# Altium schematic sheet System.SchDoc
size A3
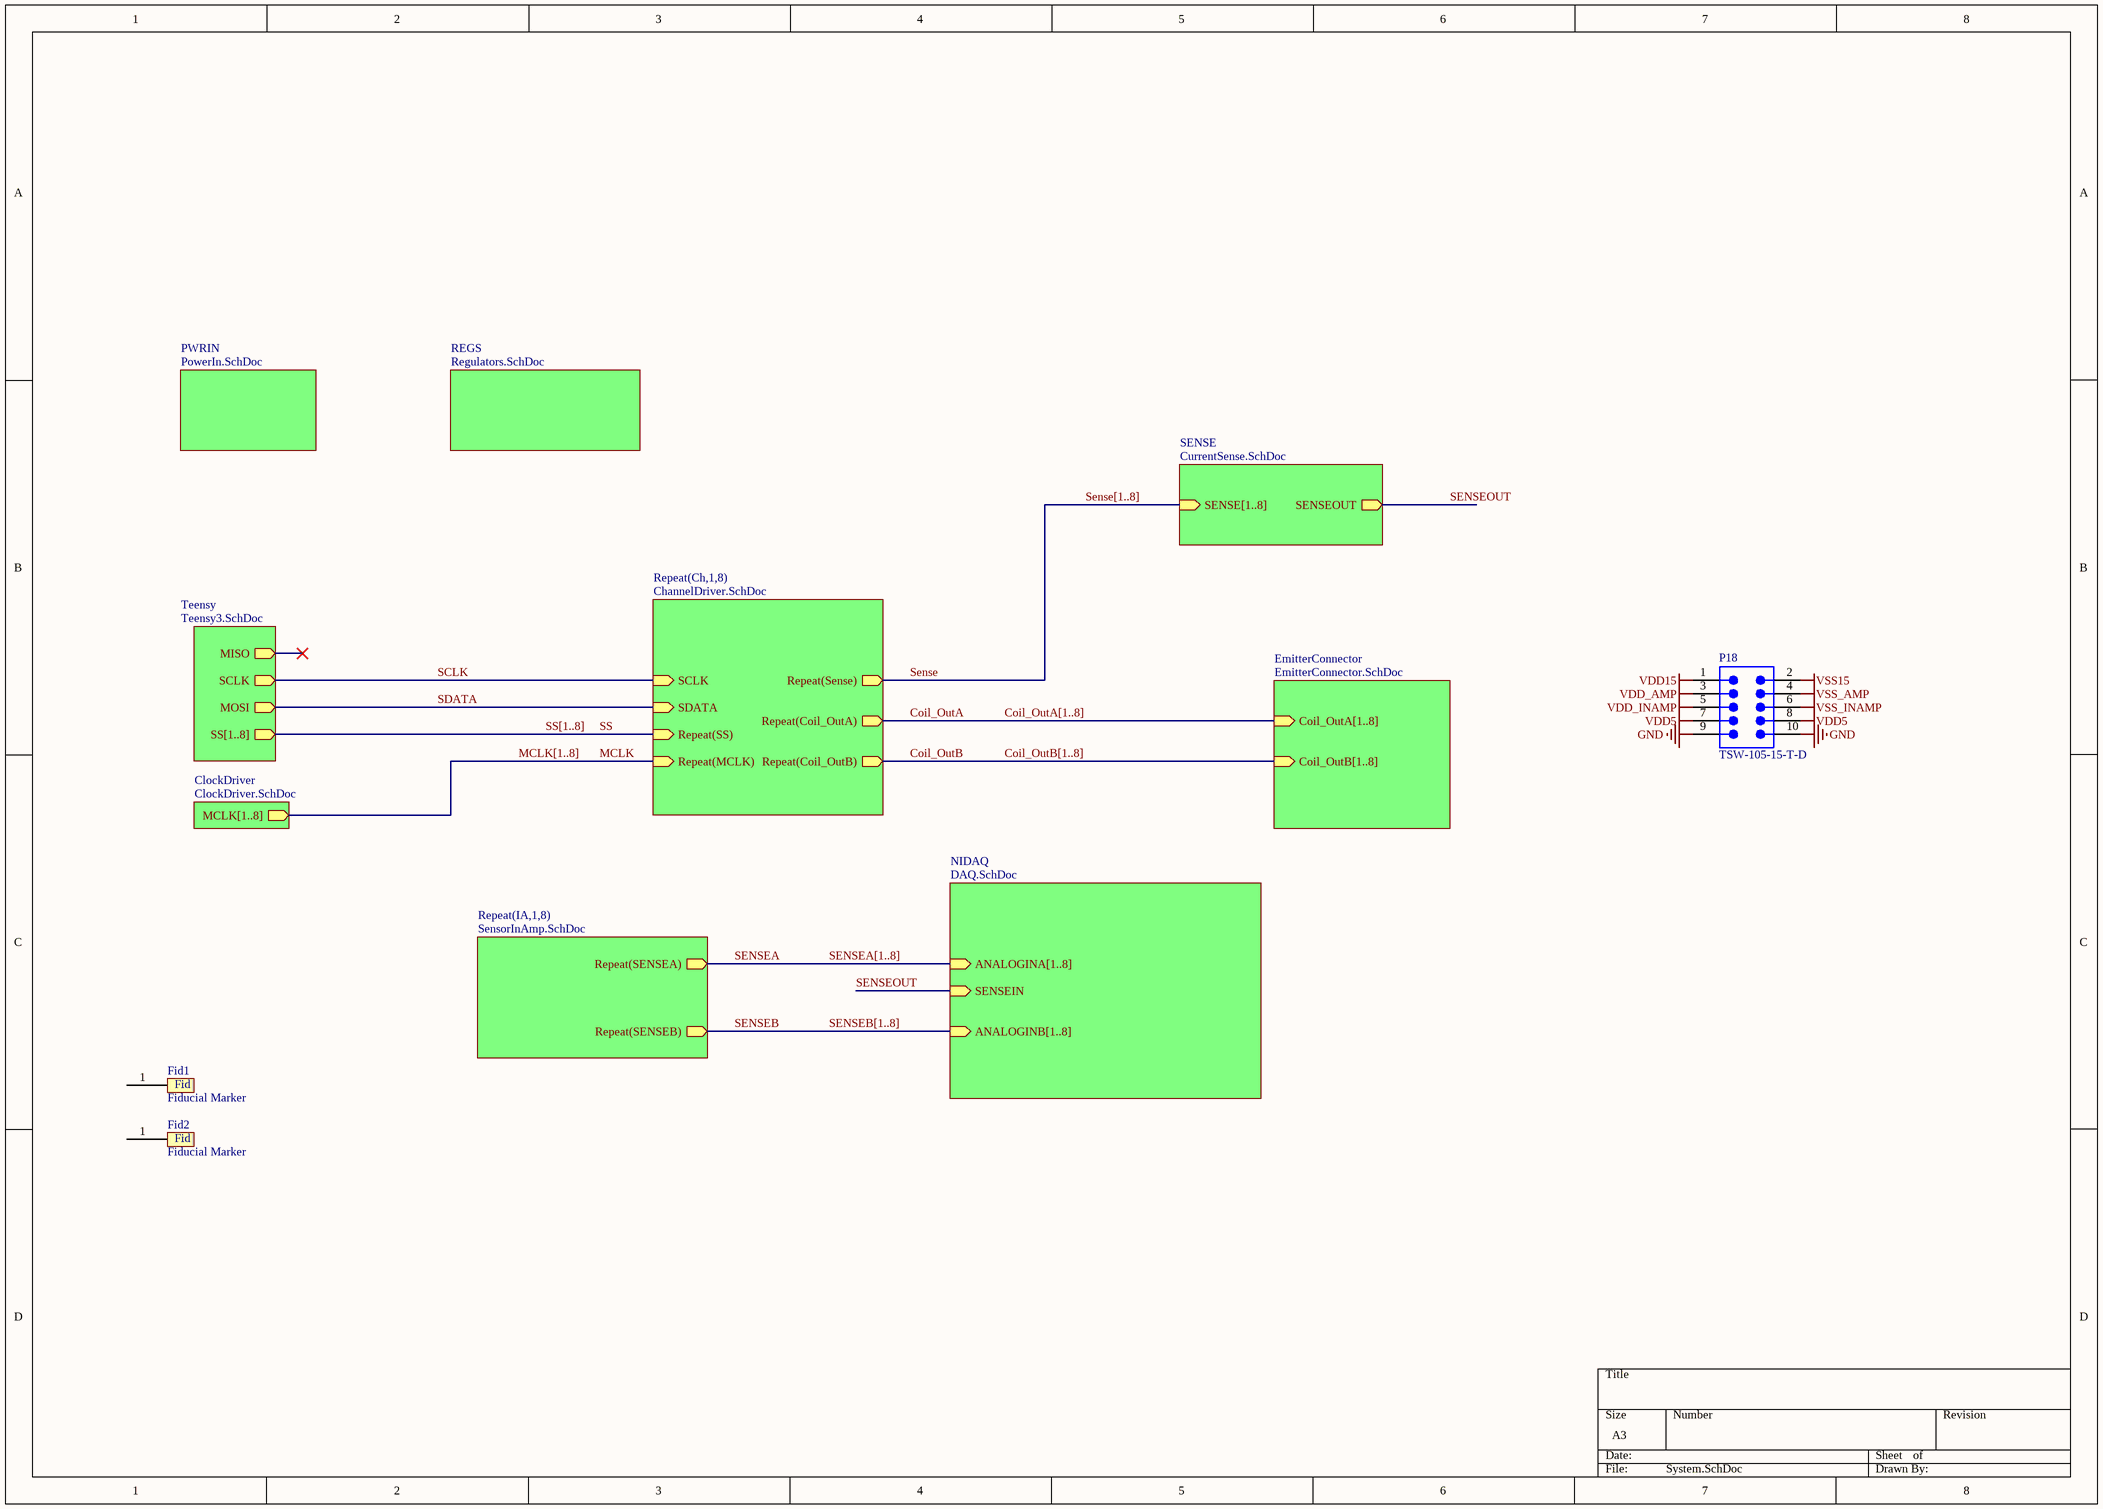
[diagram p0: System.SchDoc]

## Parts
Fid1  Fiducial Marker  [Fiducial]  (no BOM)
Fid2  Fiducial Marker  [Fiducial]  (no BOM)
P18  TSW-105-15-T-D  [SMTC-TSW-105-15-X-D]

## Sub-sheets
ClockDriver = ClockDriver.SchDoc: MCLK[1..8] (out)
EmitterConnector = EmitterConnector.SchDoc: Coil_OutA[1..8] (in), Coil_OutB[1..8] (in)
NIDAQ = DAQ.SchDoc: ANALOGINB[1..8] (in), ANALOGINA[1..8] (in), SENSEIN (in)
PWRIN = PowerIn.SchDoc: no entries
REGS = Regulators.SchDoc: no entries
Repeat(Ch,1,8) = ChannelDriver.SchDoc: SCLK (in), SDATA (in), Repeat(SS) (in), Repeat(MCLK) (in), Repeat(Coil_OutA) (out), Repeat(Coil_OutB) (out), Repeat(Sense) (out)
Repeat(IA,1,8) = SensorInAmp.SchDoc: Repeat(SENSEB) (out), Repeat(SENSEA) (out)
SENSE = CurrentSense.SchDoc: SENSE[1..8] (in), SENSEOUT (out)
Teensy = Teensy3.SchDoc: MOSI (out), SS[1..8] (out), SCLK (out), MISO (out)

## Nets
GND: P18.9 P18.10
VDD5: P18.7 P18.8
VDD15: P18.1
VDD_AMP: P18.3
VDD_INAMP: P18.5
VSS15: P18.2
VSS_AMP: P18.4
VSS_INAMP: P18.6
Coil_OutA: sheet Repeat(Ch,1,8)/Repeat(Coil_OutA)
Coil_OutB: sheet Repeat(Ch,1,8)/Repeat(Coil_OutB)
MCLK: sheet Repeat(Ch,1,8)/Repeat(MCLK)
SCLK: sheet Repeat(Ch,1,8)/SCLK, sheet Teensy/SCLK
SDATA: sheet Repeat(Ch,1,8)/SDATA, sheet Teensy/MOSI
Sense: sheet Repeat(Ch,1,8)/Repeat(Sense)
SENSEA: sheet Repeat(IA,1,8)/Repeat(SENSEA)
SENSEB: sheet Repeat(IA,1,8)/Repeat(SENSEB)
SENSEOUT: sheet NIDAQ/SENSEIN, sheet SENSE/SENSEOUT
SS: sheet Repeat(Ch,1,8)/Repeat(SS)

Not connected (* = marked no-connect by the designer): Fid1 1; Fid2 1

## Buses and harness runs
bus Coil_OutA[1..8] = sheet EmitterConnector/Coil_OutA[1..8]
bus Coil_OutB[1..8] = sheet EmitterConnector/Coil_OutB[1..8]
bus MCLK[1..8] = sheet ClockDriver/MCLK[1..8]
bus Sense[1..8] = sheet SENSE/SENSE[1..8]
bus SENSEA[1..8] = sheet NIDAQ/ANALOGINA[1..8]
bus SENSEB[1..8] = sheet NIDAQ/ANALOGINB[1..8]
bus SS[1..8] = sheet Teensy/SS[1..8]

## Notes on the sheet
- (in symbol Fiducial Marker) Fid

## Library data of the parts
P18 = CMP-1024-00368-1: Manufacturer: Samtec; Pitch: 2.54 mm; DatasheetVersion: F-214; PackageDescription: .025[0.64] SQ. Post Terminal Strip Assembly; PartNumber: TSW-105-15-T-D; PackageReference: TSW-105-15-X-D; ComponentLink2URL: http://www.samtec.com/documents/webfiles/pdf/TSW_TH.PDF; ComponentLink1URL: http://www.samtec.com; ComponentLink2Description: Datasheet; ComponentLink3Description: Package Specification; PackageVersion: DM, 8/1988; Mounting Technology: Through-hole; Temperature Range: -55 to 105 degC; ComponentLink1Description: Manufacturer URL; RoHS: True; ComponentLink3URL: http://www.samtec.com/documents/webfiles/cpdf/TSW-XXX-XX-XXX-X-XX-XXX-MKT.pdf; Orientation: Vertical